# EAGLE design Arduino_HAT (EAGLE 9.0.1)
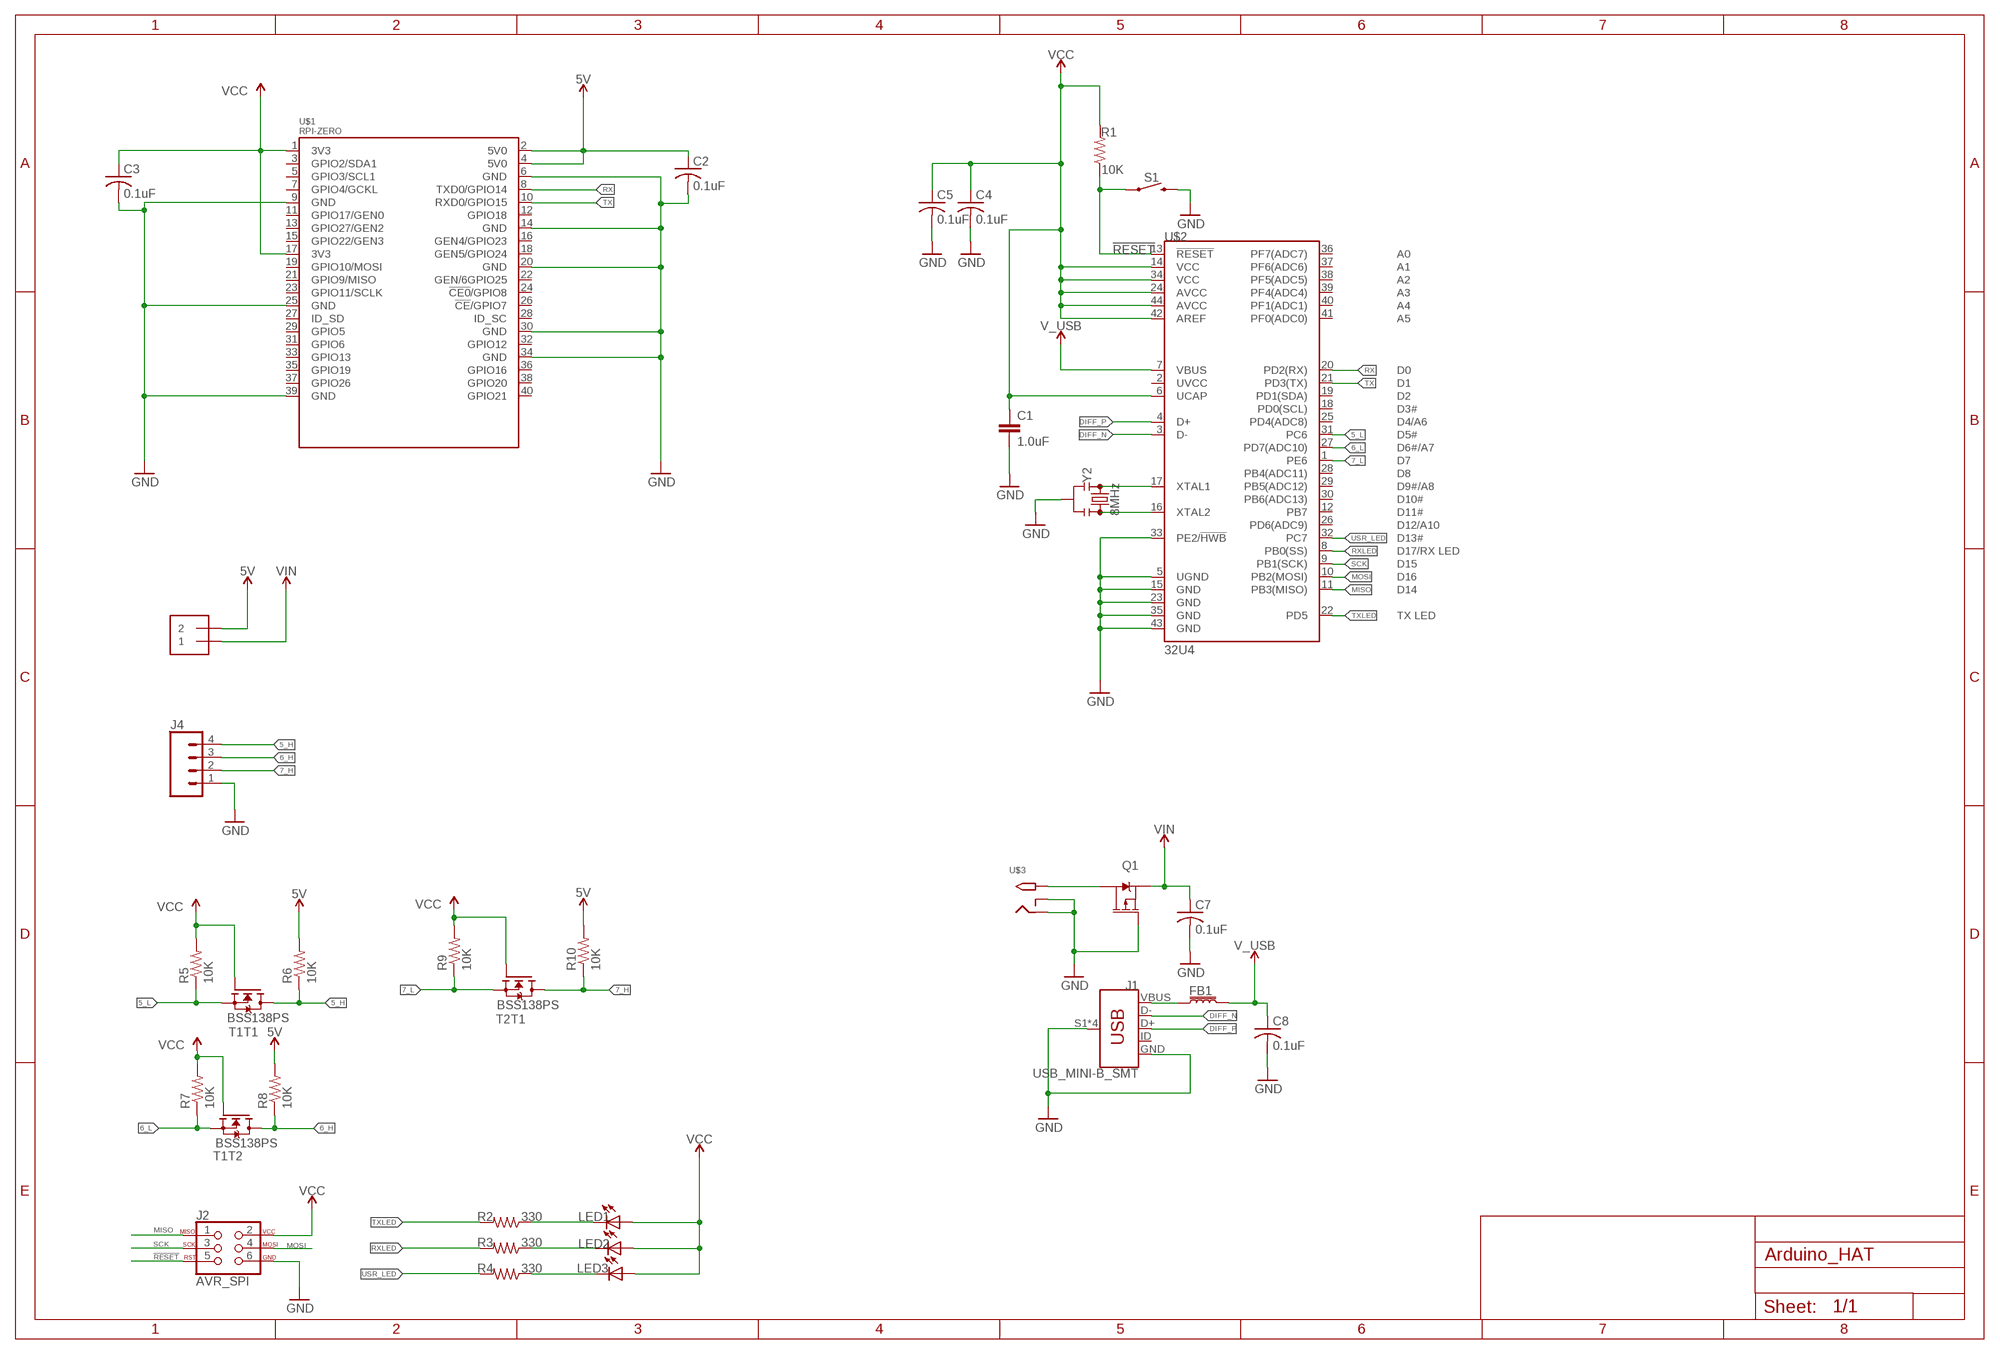
[diagram p0: schematic, sheet 1]

## Parts
C1  1.0uF  1.0UF-0805-25V-10%  [0805]
C2  0.1uF  C-USC0805  [C0805]
C3  0.1uF  C-USC0805  [C0805]
C4  0.1uF  C-USC0805  [C0805]
C5  0.1uF  C-USC0805  [C0805]
C7  0.1uF  C-USC0805  [C0805]
C8  0.1uF  C-USC0805  [C0805]
FB1  30Ω/1.8A  FERRITE_BEAD-0603  [0603]
J1  USB_MINI-B_SMT  [USB-MINIB]
J2  AVR_SPI  AVR_SPI_PROG_3X2NS  [2X3-NS]
J3  1X2-3.5MM  [1X2-3.5MM]
J4  CONN_04SCREW  [SCREWTERMINAL-3.5MM-4]
LED1  LEDCHIPLED_0805  [CHIPLED_0805]
LED2  LEDCHIPLED_0805  [CHIPLED_0805]
LED3  LEDCHIPLED_0805  [CHIPLED_0805]
Q1  2.5A/30V/105mΩ  MOSFET_PCH-DMG2307L  [SOT23-3]
R1  10K  RESISTOR0805  [0805]
R2  330  RESISTOR0805  [0805]
R3  330  RESISTOR0805  [0805]
R4  330  RESISTOR0805  [0805]
R5  10K  R-US_R0805  [R0805]
R6  10K  R-US_R0805  [R0805]
R7  10K  R-US_R0805  [R0805]
R8  10K  R-US_R0805  [R0805]
R9  10K  R-US_R0805  [R0805]
R10  10K  R-US_R0805  [R0805]
S1  MOMENTARY-SWITCH-SPST-SMD-4.6X2.8MM  [TACTILE_SWITCH_SMD_4.6X2.8MM]
T1  BSS138PS  [SOT363]
T2  BSS138PS  [SOT363]
U$1  RPI-ZERO  [RASPBERRYPI_BASTELSTUBE_V13_RASPI_BOARD_B+_FULL]
U$2  32U4  ATMEGA32U4QFN  [QFN-44]
U$3  2.1MMJACKTHM  [PJ-102A]
Y2  8MHz  RESONATOR-8MHZSMD_3.2X1.3  [RESONATOR-SMD-3.2X1.3]

## Nets
5_H: J4.4(GND) R6.1 T1.6(T1:D)
5_L: R5.1 T1.1(T1:S) U$2.31(PC6)
5V: C2.1 J3.2 R6.2 R8.2 R10.2 U$1.2(5V0) U$1.4(5V0)
6_H: J4.3(SDA) R8.1 T1.3(T2:D)
6_L: R7.1 T1.4(T2:S) U$2.27(PD7(ADC10))
7_H: J4.2(SCL) R10.1 T2.6(T1:D)
7_L: R9.1 T2.1(T1:S) U$2.1(PE6)
!RESET: J2.5 R1.1 S1.1 S1.2 U$2.13(!RESET)
DIFF_N: J1.D- U$2.3(D-)
DIFF_P: J1.D+ U$2.4(D+)
GND: C1.2 C2.2 C3.2 C4.2 C5.2 C7.2 C8.2 J1.GND J1.S1(SHIELD) J1.S2(SHIELD) J1.S3(SHIELD) J1.S4(SHIELD) J2.6 J4.1(VCC) Q1.1(G) S1.3 S1.4 U$1.6(GND) U$1.9(GND) U$1.14(GND) U$1.20(GND) U$1.25(GND) U$1.30(GND) U$1.34(GND) U$1.39(GND) U$2.5(UGND) U$2.15(GND) U$2.23(GND) U$2.33(PE2/!HWB) U$2.35(GND) U$2.43(GND) U$3.RING U$3.RING_SW Y2.2
MISO: J2.1 U$2.11(PB3(MISO))
MOSI: J2.4 U$2.10(PB2(MOSI))
N$1: U$2.16(XTAL2) Y2.3
N$2: U$2.17(XTAL1) Y2.1
N$3: FB1.1 J1.VBUS
N$4: Q1.3(D) U$3.TIP
N$8: LED1.C R2.1
N$9: LED2.C R3.1
N$10: LED3.C R4.1
RX: U$1.8(TXD0/GPIO14) U$2.20(PD2(RX))
RXLED: R3.2 U$2.8(PB0(SS))
SCK: J2.3 U$2.9(PB1(SCK))
TX: U$1.10(RXD0/GPIO15) U$2.21(PD3(TX))
TXLED: R2.2 U$2.22(PD5)
USR_LED: R4.2 U$2.32(PC7)
V_USB: C8.1 FB1.2 U$2.7(VBUS)
VCC: C1.1 C3.1 C4.1 C5.1 J2.2 LED1.A LED2.A LED3.A R1.2 R5.2 R7.2 R9.2 T1.2(T1:G) T1.5(T2:G) T2.2(T1:G) U$1.1(3V3) U$1.17(3V3) U$2.6(UCAP) U$2.14(VCC) U$2.24(AVCC) U$2.34(VCC) U$2.42(AREF) U$2.44(AVCC)
VIN: C7.1 J3.1 Q1.2(S)
Unconnected: J1.ID T2.3(T2:D) T2.4(T2:S) T2.5(T2:G) U$1.3(GPIO2/SDA1) U$1.5(GPIO3/SCL1) U$1.7(GPIO4/GCKL) U$1.11(GPIO17/GEN0) U$1.12(GPIO18) U$1.13(GPIO27/GEN2) U$1.15(GPIO22/GEN3) U$1.16(GEN4/GPIO23) U$1.18(GEN5/GPIO24) U$1.19(GPIO10/MOSI) U$1.21(GPIO9/MISO) U$1.22(GEN/6GPIO25) U$1.23(GPIO11/SCLK) U$1.24(!CE0!/GPIO8) U$1.26(!CE!/GPIO7) U$1.27(ID_SD) U$1.28(ID_SC) U$1.29(GPIO5) U$1.31(GPIO6) U$1.32(GPIO12) U$1.33(GPIO13) U$1.35(GPIO19) U$1.36(GPIO16) U$1.37(GPIO26) U$1.38(GPIO20) U$1.40(GPIO21) U$2.2(UVCC) U$2.12(PB7) U$2.18(PD0(SCL)) U$2.19(PD1(SDA)) U$2.25(PD4(ADC8)) U$2.26(PD6(ADC9)) U$2.28(PB4(ADC11)) U$2.29(PB5(ADC12)) U$2.30(PB6(ADC13)) U$2.36(PF7(ADC7)) U$2.37(PF6(ADC6)) U$2.38(PF5(ADC5)) U$2.39(PF4(ADC4)) U$2.40(PF1(ADC1)) U$2.41(PF0(ADC0))

## Library data of the parts
C1 = SparkFun-Capacitors:1.0UF: 1µF ceramic capacitors A capacitor is a passive two-terminal electrical component used to store electrical energy temporarily in an electric field.; PROD_ID: CAP-08064
C2-C5 C7 C8 = rcl:C-US: CAPACITOR, American symbol; SPICEPREFIX: C
FB1 = SparkFun-Coils:FERRITE_BEAD: Ferrite Bead (blocks, cores, rings, chokes, etc.) Inductor with layers of ferrite used to suppress high frequencies. Often used to isolate high frequency noise. SparkFun Products: IOIO-OTG - V2.2 <https://www.sparkfun.com/products/13613> SparkFun SAMD21 Mini Breakout <https://www.sparkfun.com/products/13664> SparkFun 6 Degrees of Freedom Breakout - LSM6DS3 <https://www.sparkfun.com/products/13339> SparkFun SAMD21 Dev Breakout <https://www.sparkfun.com/products/13672>; PROD_ID: NDUC-07859
J1 = SparkFun-Connectors:USB_MINI-B: USB type Mini-B Connector Breaks out 5th pin, and includes shield pins if needed. SparkFun Products: SparkFun FTDI Basic Breakout <https://www.sparkfun.com/products/9716> SparkFun XBee Explorer USB <https://www.sparkfun.com/products/11812> SparkFun Redboard <https://www.sparkfun.com/products/12757>; PROD_ID: CONN-08193; SF_ID: PRT-00587
J2 = SparkFun-Connectors:AVR_SPI_PROG_3X2: AVR ISP 6 Pin This is the reduced ISP connector for AVR programming. Common on Arduino. This footprint will take up less PCB space and can be used with a 10-pin to 6-pin adapter such as SKU: BOB-08508 **Special note about "TEST_POINT" package. The stop mask is on the top side, so if you want your programming test points to be on the bottom of your board, make sure to place this package on the bottom side of the board. This also ensure that the orientation to program from the bottom side will be correct. SparkFun Products: SparkFun ISP Pogo Adapter <https://www.sparkfun.com/products/11591> - NS Tiny AVR Programmer <https://www.sparkfun.com/products/11801> -PTH
J3 = adafruit:1X2: 3.5mm Terminal block http://www.ladyada.net/library/pcb/eaglelibrary.html
J4 = SparkFun-Connectors:CONN_04: Multi connection point. Often used as Generic Header-pin footprint for 0.1 inch spaced/style header connections On any of the 0.1 inch spaced packages, you can populate with these: Break Away Headers - Straight <https://www.sparkfun.com/products/116> (PRT-00116) Break Away Male Headers - Right Angle <https://www.sparkfun.com/products/553> (PRT-00553) Female Headers <https://www.sparkfun.com/products/115> (PRT-00115) Break Away Headers - Machine Pin <https://www.sparkfun.com/products/117> (PRT-00117) Break Away Female Headers - Swiss Machine Pin <https://www.sparkfun.com/products/743> (PRT-00743) For SCREWTERMINALS and SPRING TERMINALS visit here: Screw Terimnals on SparkFun.com <https://www.sparkfun.com/search/results?term=Screw+Terminals> (5mm/3.5mm/2.54mm spacing) This device is also useful as a general connection point to wire up your design to another part of your project. Our various solder wires solder well into these plated through hole pads. Hook-Up Wire - Assortment (Stranded, 22 AWG) <https://www.sparkfun.com/products/11375> (PRT-11375) Hook-Up Wire - Assortment (Solid Core, 22 AWG) <https://www.sparkfun.com/products/11367> (PRT-11367) View the entire wire category on our website here <https://www.sparkfun.com/categories/141> Special notes: Molex polarized connector foot print use with SKU : PRT-08231 with associated crimp pins and housings. 1MM SMD Version SKU: PRT-10208; PROD_ID: 2xCONN-08399; SF_ID: 2xPRT-08084
LED1-LED3 = adafruit:LED: LED OSRAM: - CHIPLED LG R971, LG N971, LY N971, LG Q971, LY Q971, LO R971, LY R971 LH N974, LH R974 LS Q976, LO Q976, LY Q976 LO Q996 - Hyper CHIPLED LW Q18S LB Q993, LB Q99A, LB R99A - SideLED LS A670, LO A670, LY A670, LG A670, LP A670 LB A673, LV A673, LT A673, LW A673 LH A674 LY A675 LS A676, LA A676, LO A676, LY A676, LW A676 LS A679, LY A679, LG A679 - Hyper Micro SIDELED® LS Y876, LA Y876, LO Y876, LY Y876 LT Y87S - SmartLED LW L88C, LW L88S LB L89C, LB L89S, LG L890 LS L89K, LO L89K, LY L89K LS L896, LA L896, LO L896, LY L896 - TOPLED LS T670, LO T670, LY T670, LG T670, LP T670 LSG T670, LSP T670, LSY T670, LOP T670, LYG T670 LG T671, LOG T671, LSG T671 LB T673, LV T673, LT T673, LW T673 LH T674 LS T676, LA T676, LO T676, LY T676, LB T676, LH T676, LSB T676, LW T676 LB T67C, LV T67C, LT T67C, LS T67K, LO T67K, LY T67K, LW E67C LS E67B, LA E67B, LO E67B, LY E67B, LB E67C, LV E67C, LT E67C LW T67C LS T679, LY T679, LG T679 LS T770, LO T770, LY T770, LG T770, LP T770 LB T773, LV T773, LT T773, LW T773 LH T774 LS E675, LA E675, LY E675, LS T675 LS T776, LA T776, LO T776, LY T776, LB T776 LHGB T686 LT T68C, LB T68C - Hyper Mini TOPLED® LB M676 - Mini TOPLED Santana® LG M470 LS M47K, LO M47K, LY M47K Source: http://www.osram.convergy.de/
Q1 = SparkFun-DiscreteSemi:MOSFET_PCH: P-channel MOSFETs Voltage controlled devices that allow control of high current outputs. SparkFun Products: SparkFun ESP32 Thing <https://www.sparkfun.com/products/13907> SparkFun ESP8266 Thing <https://www.sparkfun.com/products/13231>; PROD_ID: TRANS-11308
R1-R4 = SparkFun-Resistors:RESISTOR: Generic Resistor Package
R5-R10 = adafruit:R-US_: RESISTOR, American symbol
S1 = SparkFun-Switches:MOMENTARY-SWITCH-SPST: Momentary Switch (Pushbutton) - SPST Normally-open (NO) SPST momentary switches (buttons, pushbuttons). Variants PTH-12MM - 12mm square, through-hole Momentary Pushbutton Switch - 12mm Square <https://www.sparkfun.com/products/9190> (COM-09190) PTH-6.0MM, PTH-6.0MM-KIT - 6.0mm square, through-hole Mini Pushbutton Switch <https://www.sparkfun.com/products/97> (COM-00097) KIT package intended for soldering kit's - only one side of pads' copper is exposed. PTH-RIGHT-ANGLE-KIT - Right-angle, through-hole Right Angle Tactile Button <https://www.sparkfun.com/products/10791> - Used on SparkFun BigTime Watch Kit <https://www.sparkfun.com/products/11734> SMD-12MM - 12mm square, surface-mount Tactile Button - SMD (12mm) <https://www.sparkfun.com/products/12993> (COM-12993) Used on SparkFun PicoBoard <https://www.sparkfun.com/products/11888> SMD-4.5MM - 4.5mm Square Trackball Switch Used on SparkFun Blackberry Trackballer Breakout <https://www.sparkfun.com/products/13169> SMD-4.6MMX2.8MM - 4.60mm x 2.80mm, surface mount Used on SparkFun SAMD21 Mini Breakout <https://www.sparkfun.com/products/13664> SMD-5.2MM, SMD-5.2-REDUNDANT - 5.2mm square, surface-mount Mini Pushbutton Switch - SMD <https://www.sparkfun.com/products/8720> (COM-08720) Used on Arduino Pro Mini <https://www.sparkfun.com/products/11114> REDUNDANT package connects both switch circuits together SMD-6.0X3.5MM - 6.0 x 3.5mm, surface mount Momentary Reset Switch SMD <https://www.sparkfun.com/products/8229> (COM-08229) SMD-6.2MM-TALL - 6.2mm square, surface mount Tactile Button - SMD (6mm) <https://www.sparkfun.com/products/12992> Used on SparkFun Digital Sandbox <https://www.sparkfun.com/products/12651> SMD-RIGHT-ANGLE - Right-angle, surface mount Used on SparkFun Block for Intel® Edison - Arduino <https://www.sparkfun.com/products/13036>; PROD_ID: SWCH-13065
T1 T2 = we-transistor:BSS138PS: Dual N-Channel MOSFET BSS138 (Vgs>=+/-20V, Vds>=40V, Id>=0.2A + Rds<=3Ohm @ Vgs=4.5V)
U$1 = RPI-Zero:RPI-ZERO
U$2 = SparkFun-IC-Microcontroller:ATMEGA32U4: Atmel MCU, 32KByte Atmel 44-pin 8-bit Microcontroller with 32KBytes of ISP Flash and USB Controller Datasheet <http://cdn.sparkfun.com/datasheets/Dev/Arduino/Boards/ATMega32U4.pdf> SparkFun Products LilyPad Arduino USB - ATmega32U4 Board <https://www.sparkfun.com/products/12049> (DEV-12049) Pro Micro - 5V/16MHz <https://www.sparkfun.com/products/12640> (DEV-12640) Pro Micro - 3.3V/8MHz <https://www.sparkfun.com/products/12587> (DEV-12587) Fio v3 - ATmega32U4 <https://www.sparkfun.com/products/11520> (DEV-11520) Qduino Mini <https://www.sparkfun.com/products/13614> (DEV-13614) Makey Makey - Standard Kit <https://www.sparkfun.com/products/11511> (WIG-11511) Makey Makey Deluxe Kit <https://www.sparkfun.com/products/11519> (WIG-11519); PROD_ID: IC-10828
U$3 = adafruit:2.1MMJACK: 2.1mm x 5.5mm THM DC jack with internal switch. Digikey part #PJ-102A, 4UCON part #05537 2.1mm x 5.5mm SMT DC jack with internal switch. Digikey part #PJ-002A-SMT, 4UCON part #03267 By microbuilder.eu & adafruit.com
Y2 = SparkFun-Clocks:RESONATOR-8MHZ: 8MHz Resonator Digikey Example <http://www.digikey.com/product-detail/en/murata-electronics-north-america/CSTCE10M0G55-R0/490-1196-1-ND/584633> Frequency: 8MHz Frequency Stability: ±0.2% Frequency Tolerance: ±0.5% Capacitance: 33pF SparkFun Products Arduino Pro Mini 328- 3.3V/8MHz <https://www.sparkfun.com/products/11114> SparkFun Digital Sandbox <https://www.sparkfun.com/products/12651>; PROD_ID: XTAL-08895

## Net classes
1 DIFF: width 0.305 mm

## Board
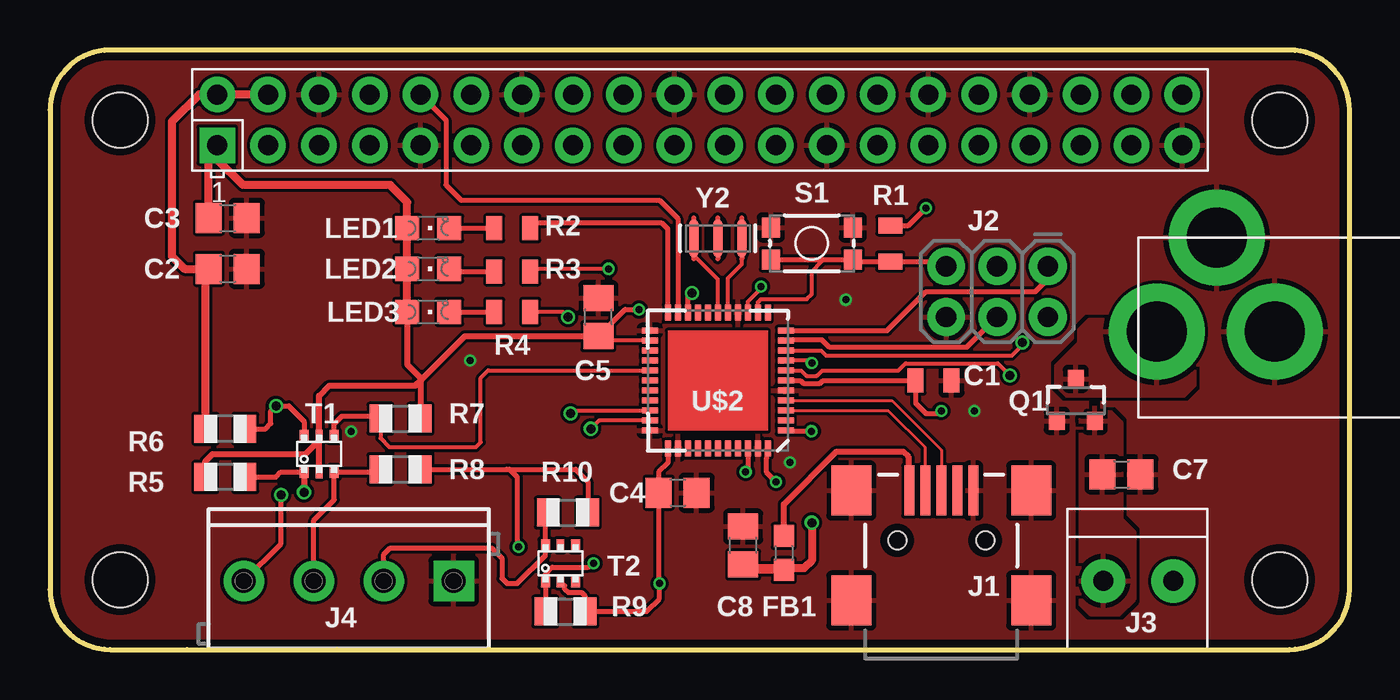
[diagram p1: board, top side]
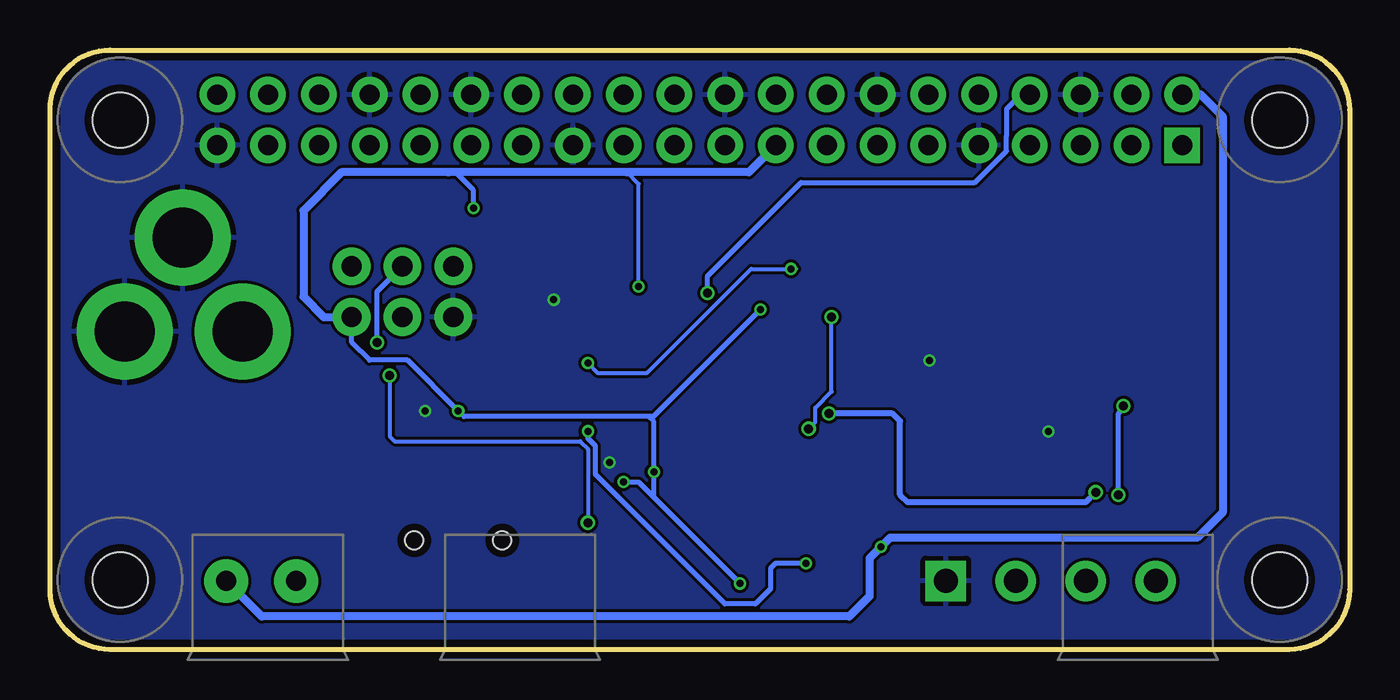
[diagram p2: board, bottom side, seen from below]

Size 65 x 30 mm. Coordinates in mm from the lower left corner, seen from the top.
Copper layers (1*16): Top 0.035559375mm / dielectric 1.6mm / Bottom 0.035559375mm
Design rules "oshpark-2layer": minimum track width 6mil, minimum drill 10mil, track to track 6mil, track to pad 6mil, pad to pad 6mil, via to via 6mil, smd to smd 6mil, copper to edge 15mil, drill to drill 6mil, minimum pad ring 5mil, minimum via ring 5mil, stop-mask expansion 2.5mil, vias tented up to drill 0mil, thermal gap 10mil

### Footprints (pad centres in the part's own frame; a part is rotated, then mirrored left to right if it is on the bottom)
0805 = smd 0.8 x 1.2: 1 -0.9,0; 2 0.9,0
C0805 = smd 1.3 x 1.5: 1 -0.95,0; 2 0.95,0
0603 = smd 1.1 x 1: 1 -0.85,0; 2 0.85,0
USB-MINIB = smd 2.5 x 0.5: D+ 2.5,0; D- 2.5,0.8; GND 2.5,-1.6; ID 2.5,-0.8; VBUS 2.5,1.6 | smd 2.5 x 2: S1 -3,4.5; S2 2.5,4.5; S3 -3,-4.5; S4 2.5,-4.5 | hole 0.9: 0,2.2; 0,-2.2
2X3-NS = drill 1.016 pad 1.88: 1 -2.54,-1.27; 2 -2.54,1.27; 3 0,-1.27; 4 0,1.27; 5 2.54,-1.27; 6 2.54,1.27
1X2-3.5MM = drill 1 pad 2.184: 1 1.8,0; 2 -1.7,0
SCREWTERMINAL-3.5MM-4 = drill 1.2 pad 2.032 square: 1 0,0 | drill 1.2 pad 2.032: 2 3.5,0; 3 7,0; 4 10.5,0
CHIPLED_0805 = smd 1.2 x 1.2: A 0,-1.05; C 0,1.05
SOT23-3 = smd 0.8 x 0.9: 1 -0.95,-1; 2 0.95,-1; 3 0,1.1
R0805 = smd 1.1 x 1.4: 1 -1,0; 2 1,0
TACTILE_SWITCH_SMD_4.6X2.8MM = smd 0.9 x 1: 1 -2.05,-0.8; 2 2.05,-0.8; 3 2.05,0.8; 4 -2.05,0.8
SOT363 = smd 0.6 x 0.5: 1 -0.9,0.75; 3 -0.9,-0.75; 4 0.9,-0.75; 6 0.9,0.75 | smd 0.6 x 0.4: 2 -0.9,0; 5 0.9,0
RASPBERRYPI_BASTELSTUBE_V13_RASPI_BOARD_B+_FULL = drill 1 pad 1.778 square: 1 8.37,25.23 | drill 1 pad 1.778: 2 8.37,27.77; 3 10.91,25.23; 4 10.91,27.77; 5 13.45,25.23; 6 13.45,27.77; 7 15.99,25.23; 8 15.99,27.77; 9 18.53,25.23; 10 18.53,27.77; 11 21.07,25.23; 12 21.07,27.77; 13 23.61,25.23; 14 23.61,27.77; 15 26.15,25.23; 16 26.15,27.77; 17 28.69,25.23; 18 28.69,27.77; 19 31.23,25.23; 20 31.23,27.77; 21 33.77,25.23; 22 33.77,27.77; 23 36.31,25.23; 24 36.31,27.77; 25 38.85,25.23; 26 38.85,27.77; 27 41.39,25.23; 28 41.39,27.77; 29 43.93,25.23; 30 43.93,27.77; 31 46.47,25.23; 32 46.47,27.77; 33 49.01,25.23; 34 49.01,27.77; 35 51.55,25.23; 36 51.55,27.77; 37 54.09,25.23; 38 54.09,27.77; 39 56.63,25.23; 40 56.63,27.77 | hole 2.75: 3.5,3.5; 3.5,26.5; 61.5,3.5; 61.5,26.5
QFN-44 = smd 0.8 x 0.3: 1 -3.4,2.5; 2 -3.4,2; 3 -3.4,1.5; 4 -3.4,1; 5 -3.4,0.5; 6 -3.4,0; 7 -3.4,-0.5; 8 -3.4,-1; 9 -3.4,-1.5; 10 -3.4,-2; 11 -3.4,-2.5; 23 3.4,-2.5; 24 3.4,-2; 25 3.4,-1.5; 26 3.4,-1; 27 3.4,-0.5; 28 3.4,0; 29 3.4,0.5; 30 3.4,1; 31 3.4,1.5; 32 3.4,2; 33 3.4,2.5 | smd 0.3 x 0.8: 12 -2.5,-3.4; 13 -2,-3.4; 14 -1.5,-3.4; 15 -1,-3.4; 16 -0.5,-3.4; 17 0,-3.4; 18 0.5,-3.4; 19 1,-3.4; 20 1.5,-3.4; 21 2,-3.4; 22 2.5,-3.4; 34 2.5,3.4; 35 2,3.4; 36 1.5,3.4; 37 1,3.4; 38 0.5,3.4; 39 0,3.4; 40 -0.5,3.4; 41 -1,3.4; 42 -1.5,3.4; 43 -2,3.4; 44 -2.5,3.4
PJ-102A = drill 3 pad 4.8: RING 0.1,-3.39; RING_SW -4.6,-6.29; TIP 0.1,-9.29
RESONATOR-SMD-3.2X1.3 = smd 0.45 x 1.905: 1 -1.2,0; 2 0,0; 3 1.2,0

### Placement (x,y rotation side)
C1  44.2,13.46 0 top
C2  8.89,19.05 0 top
C3  8.89,21.59 0 top
C4  31.39,7.85 0 top
C5  27.43,16.64 90 top
C7  53.59,8.76 0 top
C8  34.67,5.21 90 top
FB1  36.7,4.83 270 top
J1  44.58,5.46 90 top
J2  47.37,17.91 180 top
J3  54.48,3.43 180 top
J4  20.19,3.43 180 top
LED1  18.92,21.08 270 top
LED2  18.92,19.05 270 top
LED3  18.92,16.89 270 top
Q1  51.31,12.45 0 top
R1  42.04,20.32 90 top
R2  23.11,21.08 0 top
R3  23.11,18.92 0 top
R4  23.11,16.89 0 top
R5  8.76,8.64 180 top
R6  8.76,11.05 180 top
R7  17.53,11.56 0 top
R8  17.53,9.02 0 top
R9  25.78,1.91 0 top
R10  25.91,6.86 0 top
S1  38.1,20.32 0 top
T1  13.46,9.78 90 top
T2  25.53,4.32 90 top
U$1  0,0 0 top
U$2  33.4,13.46 180 top
U$3  64.64,16 270 top
Y2  33.4,20.57 0 top

### Tracks (layer width: path | path; a pad name or v marks a point on that pad's centre or on a via)
5_H  (via drill 0.45)
  Top 0.254: R6.1 10.79,11.05 11.05,11.3 11.05,11.94 v11.3,12.19 11.94,12.19 12.71,11.42 T1.6 | J4.4 11.56,5.29 v11.56,7.75
  Bottom 0.254: v11.56,7.75 11.56,11.81 11.3,12.06 v11.3,12.19
5_L  (via drill 0.45)
  Top 0.203: v26.04,11.81 26.19,11.96 U$2.31
  Top 0.254: R5.1 11.3,8.64 11.55,8.88 T1.1
  Top 0.305: T1.1 12.7,8.87 v12.7,7.87
  Bottom 0.305: v12.7,7.87 13.21,7.37 22.1,7.37 22.48,7.75 22.48,11.43 22.86,11.81 v26.04,11.81
5V  (via drill 0.35)
  Top 0.254: R8.2 22.86,9.02 22.99,9.02 | 22.99,9.02 23.37,8.64 23.37,5.08 v23.43,5.14 | 22.99,9.02 26.29,9.02 26.91,8.4 R10.2
  Top 0.406: U$1.4 U$1.2 7.45,27.77 6.1,26.42 6.1,19.68 6.73,19.05 C2.1 7.76,18.87 R6.2
  Bottom 0.406: U$1.2 7.45,27.77 6.35,26.67 6.35,6.86 7.62,5.59 22.99,5.59 v23.43,5.14 24,4.57 24,2.67 25.02,1.65 54.41,1.65 J3.2
6_H
  Top 0.254: J4.3 13.19,6.46 14.22,7.49 14.21,7.5 T1.3 16.39,8.88 R8.1
6_L
  Top 0.203: R7.1 16.53,10.58 16.97,10.13 21.31,10.13 21.54,10.36 21.54,13.59 21.92,13.97 U$2.27
  Top 0.254: T1.4 14.21,11.29 14.61,11.68 16.4,11.68 R7.1
7_H
  Top 0.254: R10.1 24.78,6.73 T2.6 24.78,4.71 23.37,3.3 22.86,3.3 22.61,3.56 22.61,4.57 22.1,5.08 17.02,5.08 16.69,4.75 J4.2
7_L  (via drill 0.35)
  Top 0.254: R9.1 T2.1 24.78,3.77 25.12,4.12 26.92,4.12 27.15,4.34 v27.18,4.32 | v38.1,10.93 36.84,10.93 U$2.1
  Bottom 0.254: v27.18,4.32 28.7,4.32 28.96,4.06 28.96,3.05 29.72,2.29 31.24,2.29 37.72,8.76 37.72,10.19 38.1,10.57 v38.1,10.92 v38.1,10.93
!RESET
  Top 0.203: U$2.13 35.4,17.37 35.56,17.53 37.85,17.53 38.1,17.78 38.1,18.92 38.61,19.43 38.61,19.52
  Top 0.254: S1.1 38.61,19.52 S1.2 40.25,19.42 R1.1 44.59,19.42 J2.5
DIFF_N
  Top 0.152: U$2.3 41.92,11.96 43.78,10.11 J1.D-
DIFF_P
  Top 0.152: U$2.4 42.11,12.46 44.58,9.99 J1.D+
GND  (via drill 0.35)
  other vias: 46.23,11.94 37.01,9.37 21.01,14.45 15.06,10.92 39.8,17.5
  pour Top (rank 6): 0,0 66.04,0 66.04,2.54 66.04,30.48 0,30.48
  pour Bottom (rank 6): 0,0 66.04,0 66.04,30.48 0,30.48
MISO
  Top 0.254: U$2.11 41.87,15.96 43.81,17.91 49.28,17.91 49.91,18.54 J2.1
MOSI
  Top 0.254: J2.4 45.85,15.11 38.99,15.11 38.61,15.49 36.83,15.49 U$2.10
N$1
  Top 0.203: U$2.16 33.9,18.59 34.6,19.29 Y2.3
N$2
  Top 0.203: U$2.17 33.4,18.52 32.2,19.72 Y2.1
N$3
  Top 0.305: FB1.1 36.7,7.27 39.34,9.91 42.67,9.91 42.93,9.65 42.93,8.01 J1.VBUS
N$4
  pour Top: 50.8,12.7 56.77,12.7 57.28,13.21 57.28,16.13 56.9,16.51 51.94,16.51 51.44,16 51.44,15.37 50.29,14.22 50.29,13.46 50.29,13.21
N$8
  Top 0.254: LED1.C R2.1
N$9
  Top 0.254: LED2.C 20.1,18.92 R3.1
N$10
  Top 0.254: LED3.C R4.1
RX  (via drill 0.45)
  Top 0.254: U$2.20 31.9,17.8 32,17.91 32.07,17.84 v32.11,17.84
  Bottom 0.254: v32.11,17.84 32.11,18.69 27.43,23.37 18.74,23.37 17.16,24.95 17.16,25.71 17.14,25.73 17.14,27.05 16.43,27.77 U$1.8
RXLED  (via drill 0.35)
  Top 0.203: U$2.8 36.82,14.48 37.97,14.48 38.1,14.35 v38.1,14.33 | v27.94,19.05 24.14,19.05 R3.2
  Bottom 0.203: v38.1,14.33 37.61,13.84 35.14,13.84 29.94,19.05 v27.94,19.05 27.69,19.05
SCK  (via drill 0.45)
  Top 0.203: U$2.9 38.56,14.96 38.82,14.71 48.11,14.71 48.64,15.24
  Top 0.254: 48.64,15.24 v48.64,15.37
  Bottom 0.254: v48.64,15.37 48.64,17.91 J2.3
TX
  Top 0.254: U$1.10 19.81,26.49 19.81,23.24 20.57,22.48 30.48,22.48 31.4,21.56 U$2.21
TXLED
  Top 0.254: U$2.22 30.9,21.04 30.61,21.34 24.27,21.34 R2.2
USR_LED  (via drill 0.45)
  Top 0.203: U$2.32 27.46,11.46 v27.05,11.05 | v25.91,16.64 25.65,16.89 R4.2
  Bottom 0.203: v27.05,11.05 26.72,11.38 26.72,12.09 25.91,12.9 v25.91,16.64
V_USB  (via drill 0.45)
  Top 0.203: v48.01,13.72 47.41,14.32 42.79,14.32 42.44,13.96 38.63,13.96 38.36,13.7 37.84,13.7 37.57,13.96 U$2.7
  Top 0.254: U$2.7
  Top 0.406: v38.1,6.35 38.1,4.45 37.72,4.06 34.86,4.06 C8.1 34.95,3.98 FB1.2
  Bottom 0.203: v48.01,13.72 48.01,10.67 47.75,10.41 38.48,10.41 38.1,10.03 v38.1,6.35
VCC  (via drill 0.35)
  Top 0.203: U$2.14 34.9,17.4 35.56,18.06 v35.56,18.16 | U$2.24 27.66,15.46
  Top 0.254: U$2.6 37.53,13.46 37.68,13.32 38.52,13.32 38.66,13.46 C1.1 43.3,12.33 43.81,11.81 44.45,11.81 v44.58,11.94 | R1.2 42.94,21.22 v43.81,22.1 | C5.1 28.76,17.02 v29.46,17.02 | U$2.42 34.9,8.89 | 34.9,8.89 34.92,8.87 | 34.9,8.89 v34.8,8.89 | U$2.44 35.83,9.99 35.83,9.55 35.81,9.53 35.81,8.89 v36.32,8.38 | U$2.34 30.9,9.34 30.44,8.88 C4.1 30.44,3.34 v30.48,3.3 30.48,2.54 29.84,1.91 R9.2 26.78,2.66 26.6,2.84 25.93,2.84 25.75,3.02 25.75,3.2 T2.2
  Top 0.305: LED3.A 17.87,14.26 18.54,13.59 18.53,13.57 18.53,13.46 | 18.53,13.46 R7.2 | T1.5 13.46,12.7 13.97,13.21 18.27,13.21 18.53,13.46 | T1.2 T1.5 | R5.2 7.76,9.41 8.13,9.78 12.78,9.78 13.46,10.46 T1.5 | 27.66,15.46 C5.1 20.75,15.69 18.53,13.46
  Top 0.406: C3.1 7.94,24.8 U$1.1 8.37,24.52 9.65,23.24 17.02,23.24 17.87,22.39 LED1.A | LED3.A LED1.A | LED2.A LED1.A
  Bottom 0.203: v35.56,18.16 35.56,23.29 36.14,23.88
  Bottom 0.254: v43.81,22.1 43.81,22.99 44.7,23.88 45.09,23.88 | J2.2 49.91,15.37 49.02,14.48 47.12,14.48 v44.58,11.94 44.3,11.66 35.05,11.66 | v29.46,17.02 34.82,11.66 35.05,11.66 | v30.48,3.3 34.8,7.62 | 34.8,7.62 v34.8,8.89 34.8,11.4 35.05,11.66 | v36.32,8.38 35.56,8.38 34.8,7.62
  Bottom 0.406: U$1.17 30.04,23.88 36.14,23.88 45.09,23.88 50.42,23.88 52.32,21.97 52.32,17.65 51.31,16.64 J2.2
VIN
  pour Top: 54.23,2.67 54.23,5.84 53.59,6.48 53.59,11.3 52.96,11.94 52.83,12.06 51.82,12.06 51.56,11.81 51.56,11.56 51.56,2.41 51.56,2.29 51.94,1.91 52.07,1.78 53.21,1.78 53.47,1.78 54.23,2.54